# Altium schematic sheet moFOC_Supply.SchDoc
size A4; Organization: Altium Limited; Address1: L3, 12a Rodborough Rd; Address2: Frenchs Forest; Address3: NSW; Address4: Australia 2086
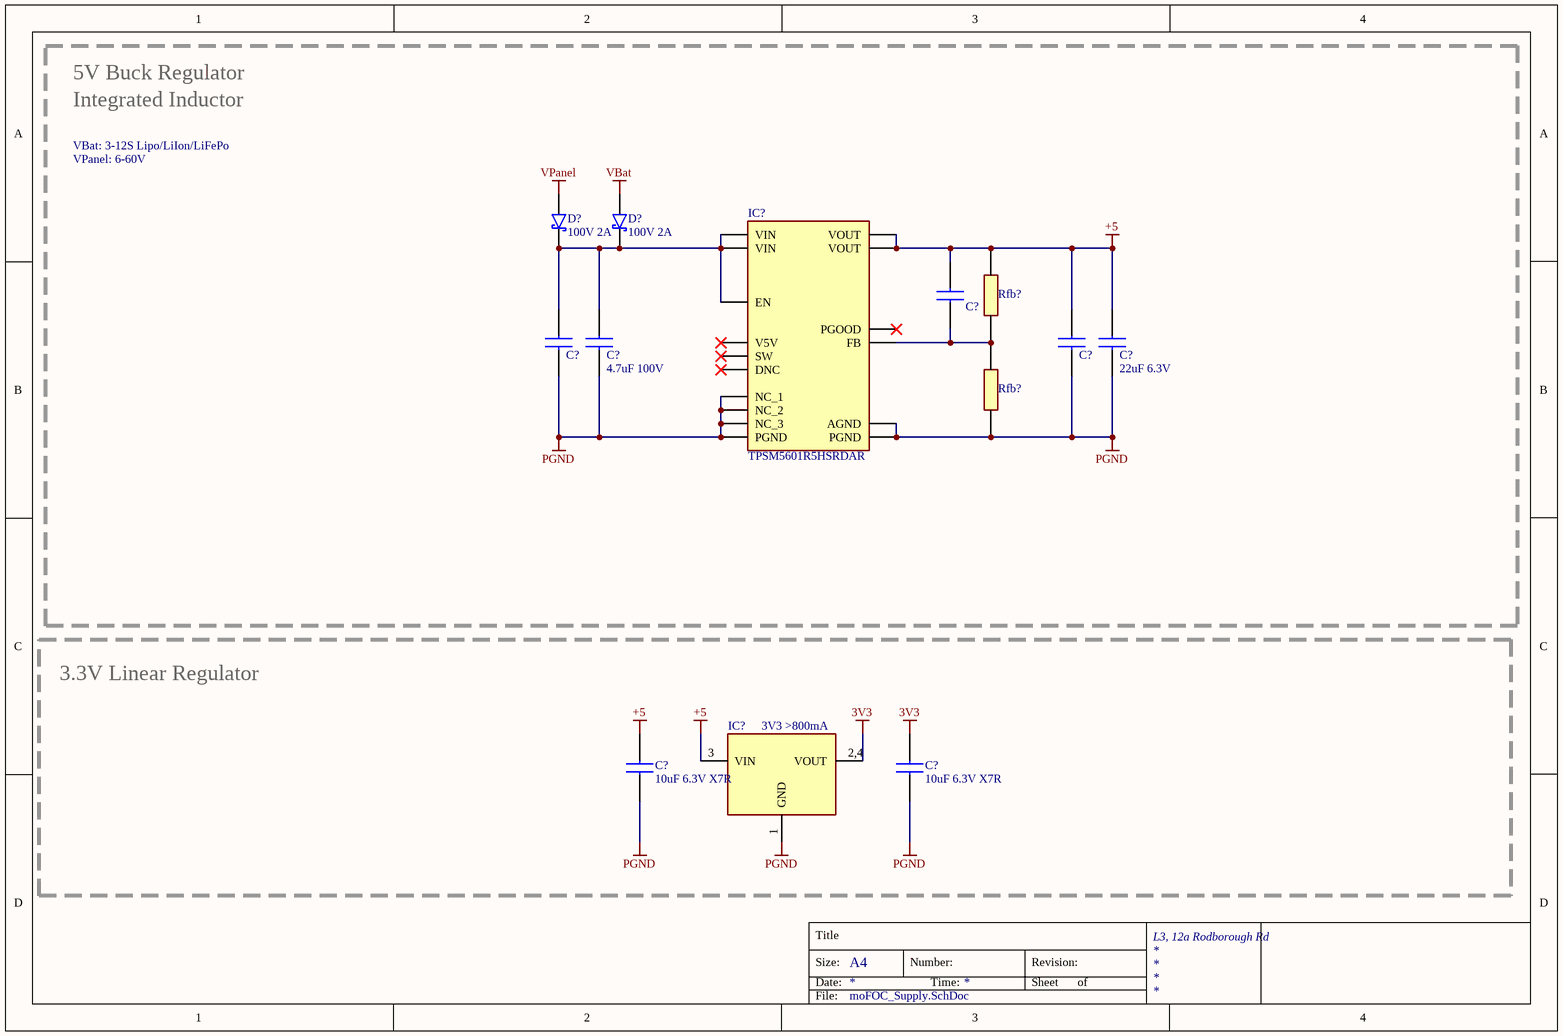
[diagram p0: moFOC_Supply.SchDoc]

## Parts
(Parts that share a designator on the sheet are numbered #1, #2 ... from top to bottom, then left to right.)
C?#1  C0603  [CAPC1608X97N]  (value not drawn)
C?#2  4.7uF 100V  [CAPC3225X270N]  (value not drawn)
C?#3  4.7uF 100V  [CAPC3225X270N]
C?#4  22uF 6.3V  [CAPC3225X270N]  (value not drawn)
C?#5  22uF 6.3V  [CAPC3225X270N]
C?#6  10uF 6.3V X7R  [CAPC3216X180N]
C?#7  10uF 6.3V X7R  [CAPC3216X180N]
D?#1  100V 2A  [SOD-123FL]
D?#2  100V 2A  [SOD-123FL]
IC?#1  TPSM5601R5HSRDAR  [TPSM5601R5HSRDAR]
IC?#2  3V3 >800mA  [SOT230P700X180-4N]
Rfb?#1  R0603  [RESC1608X50N]  (value not drawn)
Rfb?#2  R0603  [RESC1608X50N]  (value not drawn)

## Blocks framed on the sheet
3.3V Linear Regulator: C?#6 C?#7 IC?#2

## Nets
3V3: C?#7.2 IC?#2.2,4(VOUT)
+5: C?#1.2 C?#4.2 C?#5.2 C?#6.2 IC?#1.7(VOUT) IC?#1.8(VOUT) IC?#2.3(VIN) Rfb?#1.2
PGND: C?#2.1 C?#3.1 C?#4.1 C?#5.1 C?#6.1 C?#7.1 IC?#1.3(NC_1) IC?#1.6(NC_2) IC?#1.10(AGND) IC?#1.13(NC_3) IC?#1.15,_16(PGND) IC?#1.17(PGND) IC?#2.1(GND) Rfb?#2.1
VBat: D?#2.2(A)
VPanel: D?#1.2(A)
NetC?#1_1: C?#1.1 IC?#1.9(FB) Rfb?#1.1 Rfb?#2.2
NetC?#2_2: C?#2.2 C?#3.2 D?#1.1(K) D?#2.1(K) IC?#1.1(VIN) IC?#1.2(EN) IC?#1.14(VIN)

Not connected (* = marked no-connect by the designer): IC?#1 4(SW)* 5(DNC)* 11(V5V)* 12(PGOOD)*

## Notes on the sheet
- 5V Buck Regulator
- Integrated Inductor
- VBat: 3-12S Lipo/LiIon/LiFePo
- VPanel: 6-60V
- Title
- Size:
- Date:
- A4
- Number:
- Time:
- Revision:
- Sheet
- of
- File:

## Library data of the parts
C?#1 = C0603: Capacitor; Height: 0.97
C?#2-C?#5 = C1210: Capacitor; Manufacturer_Name: Vishay; Manufacturer_Part_Number: VJ0603Y104JXJAC; Datasheet Link: http://www.vishay.com/docs/45226/vj31xrohsautomlcc.pdf; Height: 0.97mm; Mouser Part Number: 77-VJ0603Y104JXJAC; Mouser Price/Stock: https://www.mouser.com/Search/Refine.aspx?Keyword=77-VJ0603Y104JXJAC
C?#6 C?#7 = C1206: Capacitor; Height: 1.8mm
D?#1 D?#2 = SCHOTTKY-DIODE: Schottky Diode
IC?#1 = TPSM5601R5HSRDAR: Integrated Circuit; pin to pad: 15, 16>15+16; Manufacturer_Name: Texas Instruments; Datasheet Link: https://www.ti.com/lit/ds/symlink/tpsm5601r5h.pdf?ts=1622688238120&ref_url=https%253A%252F%252Fcomponentsearchengine.com%252F; Height: 4.1mm; Manufacturer_Part_Number: TPSM5601R5HSRDAR; Mouser Part Number: 595-TPSM5601R5HSRDAR; Mouser Price/Stock: https://www.mouser.co.uk/ProductDetail/Texas-Instruments/TPSM5601R5HSRDAR?qs=DRkmTr78QARQPwPAx4O%252BKQ%3D%3D; Arrow Part Number: TPSM5601R5HSRDAR; Arrow Price/Stock: https://www.arrow.com/en/products/tpsm5601r5hsrdar/texas-instruments?region=nac
IC?#2 = LDO-SOT223: LDO
Rfb?#1 Rfb?#2 = R0603: Resistor; Manufacturer_Name: Panasonic; Manufacturer_Part_Number: ERJ-PA3J104V; Datasheet Link: https://industrial.panasonic.com/cdbs/www-data/pdf/RDO0000/AOA0000C331.pdf; Height: 0.55mm; Mouser Part Number: 667-ERJ-PA3J104V; Mouser Price/Stock: https://www.mouser.co.uk/ProductDetail/Panasonic/ERJ-PA3J104V/?qs=BzJM0faLVqV4tD3ZRAThew%3D%3D; Arrow Part Number: ERJ-PA3J104V; Arrow Price/Stock: https://www.arrow.com/en/products/erj-pa3j104v/panasonic